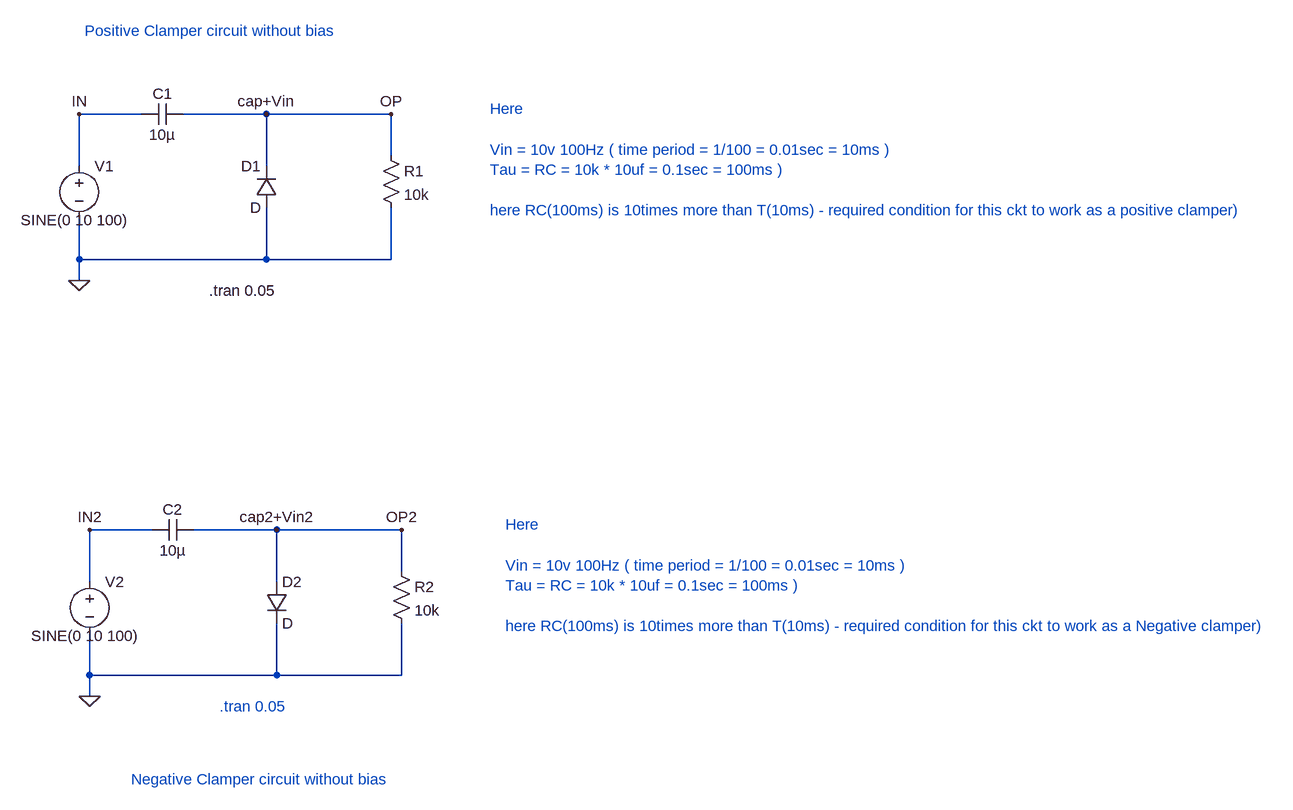
[diagram p0: schematic Clamper_circuit_without_bias.asc]
Clamper_circuit_without_bias.asc, the LTspice schematic file:
Version 4.1
SHEET 1 1976 1072
WIRE 128 32 32 32
WIRE 320 32 192 32
WIRE 512 32 320 32
WIRE 512 96 512 32
WIRE 32 112 32 32
WIRE 320 112 320 32
WIRE 32 256 32 192
WIRE 320 256 320 176
WIRE 320 256 32 256
WIRE 512 256 512 176
WIRE 512 256 320 256
WIRE 32 288 32 256
WIRE 144 672 48 672
WIRE 336 672 208 672
WIRE 528 672 336 672
WIRE 528 736 528 672
WIRE 48 752 48 672
WIRE 336 752 336 672
WIRE 48 896 48 832
WIRE 336 896 336 816
WIRE 336 896 48 896
WIRE 528 896 528 816
WIRE 528 896 336 896
WIRE 48 928 48 896
FLAG 32 288 0
FLAG 32 32 IN
FLAG 320 32 cap+Vin
FLAG 512 32 OP
FLAG 48 928 0
FLAG 48 672 IN2
FLAG 336 672 cap2+Vin2
FLAG 528 672 OP2
SYMBOL voltage 32 96 R0
WINDOW 3 -90 99 Left 2
WINDOW 123 0 0 Left 0
WINDOW 39 0 0 Left 0
SYMATTR Value SINE(0 10 100)
SYMATTR InstName V1
SYMBOL cap 192 16 R90
WINDOW 0 0 32 VBottom 2
WINDOW 3 32 32 VTop 2
SYMATTR InstName C1
SYMATTR Value 10µ
SYMATTR SpiceLine V=25
SYMBOL diode 336 176 R180
WINDOW 0 24 64 Left 2
WINDOW 3 24 0 Left 2
SYMATTR InstName D1
SYMBOL res 496 80 R0
SYMATTR InstName R1
SYMATTR Value 10k
SYMBOL voltage 48 736 R0
WINDOW 3 -90 99 Left 2
WINDOW 123 0 0 Left 0
WINDOW 39 0 0 Left 0
SYMATTR Value SINE(0 10 100)
SYMATTR InstName V2
SYMBOL cap 208 656 R90
WINDOW 0 0 32 VBottom 2
WINDOW 3 32 32 VTop 2
SYMATTR InstName C2
SYMATTR Value 10µ
SYMATTR SpiceLine V=25
SYMBOL diode 320 752 R0
SYMATTR InstName D2
SYMBOL res 512 720 R0
SYMATTR InstName R2
SYMATTR Value 10k
TEXT 232 304 Left 2 !.tran 0.05
TEXT 664 24 Left 2 ;Here \n \nVin = 10v 100Hz ( time period = 1/100 = 0.01sec = 10ms )\nTau = RC = 10k * 10uf = 0.1sec = 100ms )\n \nhere RC(100ms) is 10times more than T(10ms) - required condition for this ckt to work as a positive clamper)
TEXT 248 944 Left 2 ;.tran 0.05
TEXT 40 -96 Left 2 ;Positive Clamper circuit without bias
TEXT 112 1056 Left 2 ;Negative Clamper circuit without bias
TEXT 688 664 Left 2 ;Here \n \nVin = 10v 100Hz ( time period = 1/100 = 0.01sec = 10ms )\nTau = RC = 10k * 10uf = 0.1sec = 100ms )\n \nhere RC(100ms) is 10times more than T(10ms) - required condition for this ckt to work as a Negative clamper)

The netlist it stands for:
* Clamper_circuit_without_bias.asc
V1 IN 0 SINE(0 10 100)
C1 OP IN 10µ V=25
D1 0 OP D
R1 OP 0 10k
V2 IN2 0 SINE(0 10 100)
C2 OP2 IN2 10µ V=25
D2 OP2 0 D
R2 OP2 0 10k
.model D D
.lib standard.dio
.tran 0.05
* Here
* Vin = 10v 100Hz ( time period = 1/100 = 0.01sec = 10ms )
* Tau = RC = 10k * 10uf = 0.1sec = 100ms )
* here RC(100ms) is 10times more than T(10ms) - required condition for this ckt to work as a positive clamper)
* .tran 0.05
* Positive Clamper circuit without bias
* Negative Clamper circuit without bias
* Here
* Vin = 10v 100Hz ( time period = 1/100 = 0.01sec = 10ms )
* Tau = RC = 10k * 10uf = 0.1sec = 100ms )
* here RC(100ms) is 10times more than T(10ms) - required condition for this ckt to work as a Negative clamper)
.backanno
.end

* Results of the author's LTspice run, read from the files saved beside the schematic
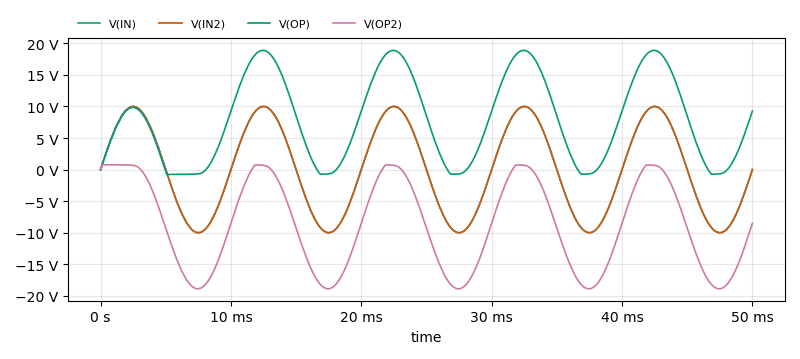
[diagram p1: Transient Analysis of Clamper_circuit_without_bias.asc, plotted from the saved traces]
* Transient Analysis, 1 run:
*   V(IN): min -10 V, max 10 V, average -117.8 µV, rms 7.08 V, last 0 V
*   V(IN2): min -10 V, max 10 V, average -117.8 µV, rms 7.08 V, last 0 V
*   V(OP): min -766.6 mV, max 18.88 V, average 7.868 V, rms 10.44 V, last 9.265 V
*   V(OP2): min -18.88 V, max 762.1 mV, average -8.772 V, rms 11.33 V, last -8.503 V